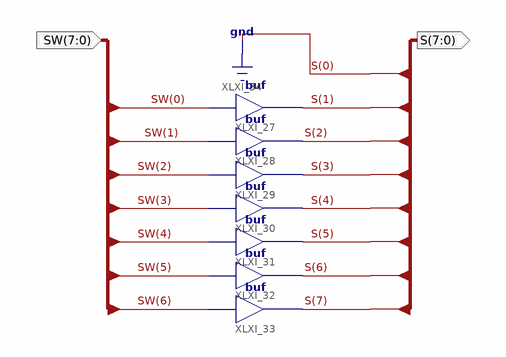
[diagram p0: schematic sheet 1]
// Xilinx ISE schematic SHL.sch (spartan6) as structural Verilog: 7 symbols, 2 ports
module SHL (
  input  [7:0] SW,
  output [7:0] S
);

  buf XLXI_27 (S[1], SW[0]);
  buf XLXI_28 (S[2], SW[1]);
  buf XLXI_29 (S[3], SW[2]);
  buf XLXI_30 (S[4], SW[3]);
  buf XLXI_31 (S[5], SW[4]);
  buf XLXI_32 (S[6], SW[5]);
  buf XLXI_33 (S[7], SW[6]);

  assign S[0] = 1'b0;
endmodule
